# Altium schematic sheet ATU_RF.SchDoc: Приемопередатчик  SDR200
size 420 x 297 mm; Author: В.Титов; DrawnBy: В.Титов; DocumentNumber: ХХХХ.468179.001 Э3; SheetNumber: 2; SheetTotal: 3; DocumentType: Схема электрическая принципиальная; Title2: Согласующее устройство; Scale: 1:1
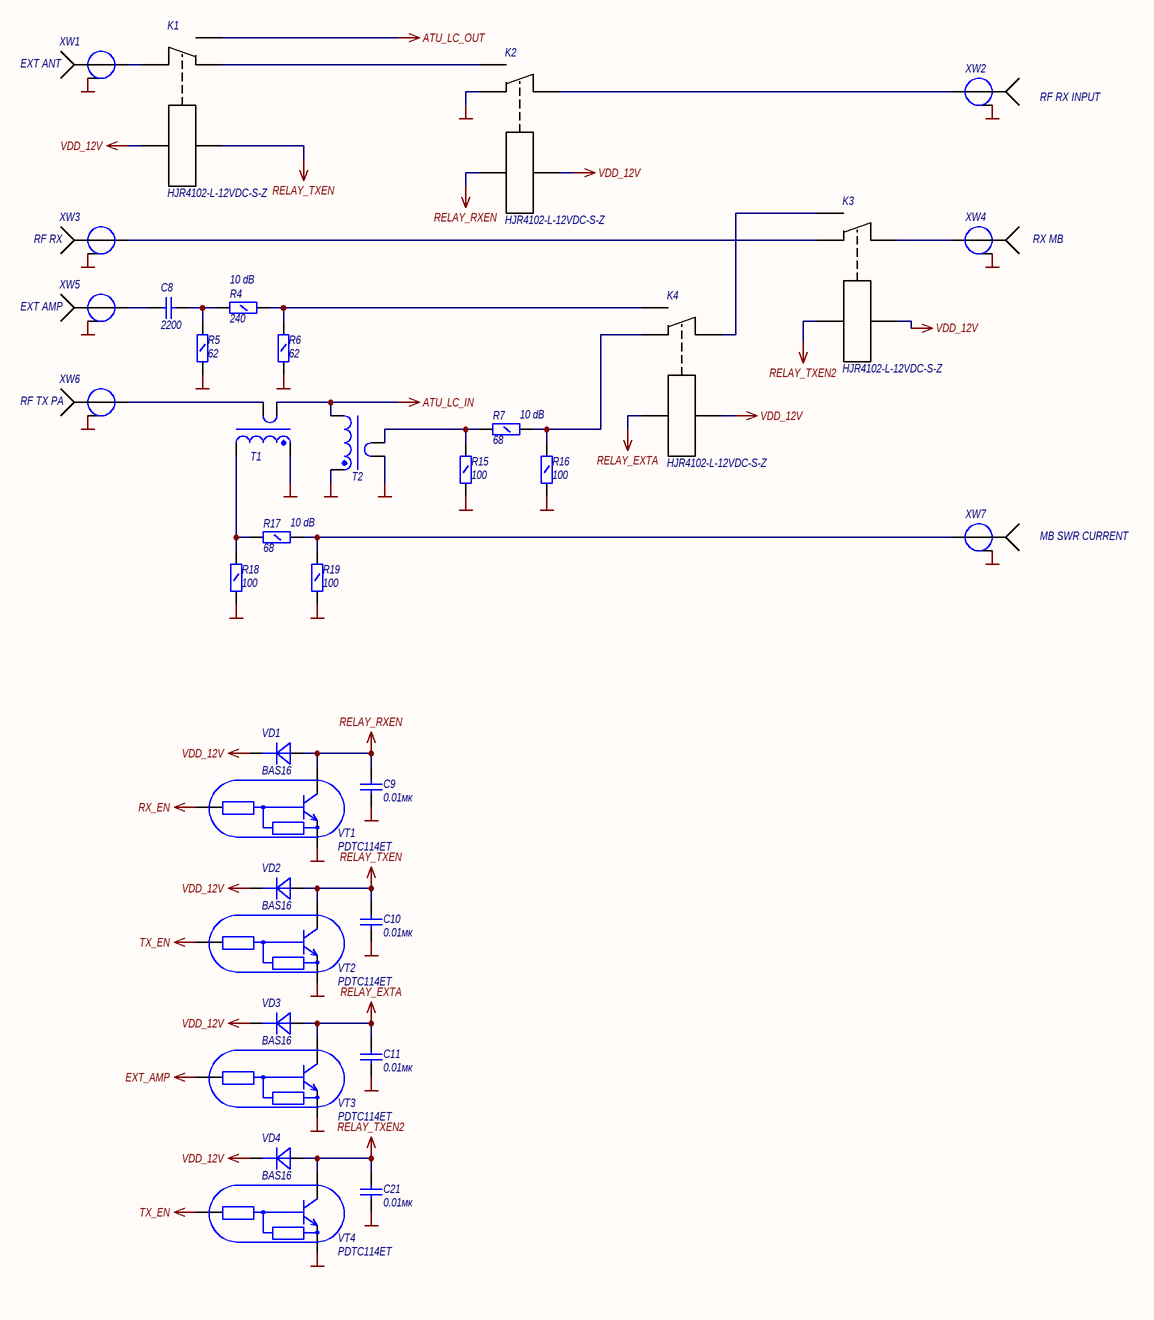
[diagram p0: ATU_RF.SchDoc]

## Parts
C8  2200  [CAPC3216X19L]
C9  0.01мк  [CAPC1005X06N]
C10  0.01мк  [CAPC1005X06N]
C11  0.01мк  [CAPC1005X06N]
C21  0.01мк  [CAPC1005X06N]
K1  HJR4102-L-12VDC-S-Z  [HJR4102]
K2  HJR4102-L-12VDC-S-Z  [HJR4102]
K3  HJR4102-L-12VDC-S-Z  [HJR4102]
K4  HJR4102-L-12VDC-S-Z  [HJR4102]
R4  240  [RESC3216X04L]
R5  62  [RESC3216X04L]
R6  62  [RESC3216X04L]
R7  68  [RESC3216X04L]
R15  100  [RESC3216X04L]
R16  100  [RESC3216X04L]
R17  68  [RESC3216X04L]
R18  100  [RESC3216X04L]
R19  100  [RESC3216X04L]
T1  Трансформатор SWR_CURRENT  [TRSF PA CURRENT]  (value not drawn)
T2  Трансформатор SWR_VOLTAGE  [TRSF PA VOLTAGE]  (value not drawn)
VD1  BAS16  [SOT23_N]
VD2  BAS16  [SOT23_N]
VD3  BAS16  [SOT23_N]
VD4  BAS16  [SOT23_N]
VT1  PDTC114ET  [SOT23_N]
VT2  PDTC114ET  [SOT23_N]
VT3  PDTC114ET  [SOT23_N]
VT4  PDTC114ET  [SOT23_N]
XW1  SMA-JR  [SMA-JR]  (value not drawn)
XW2  SMA-JR  [SMA-JR]  (value not drawn)
XW3  SMA-JR  [SMA-JR]  (value not drawn)
XW4  SMA-JR  [SMA-JR]  (value not drawn)
XW5  SMA-JR  [SMA-JR]  (value not drawn)
XW6  SMA-JR  [SMA-JR]  (value not drawn)
XW7  SMA-JR  [SMA-JR]  (value not drawn)

## Nets
ATU_LC_IN: T1.1 T2.4
ATU_LC_OUT: K1.6
EXT_AMP: VT3.1(B)
GND: C9.1 C10.1 C11.1 C21.1 K2.7 R5.1 R6.1 R15.1 R16.1 R18.1 R19.1 T1.3 T2.1 T2.3 VT1.2(E) VT2.2(E) VT3.2(E) VT4.2(E) XW1.2 XW2.2 XW3.2 XW4.2 XW5.2 XW6.2 XW7.2
RELAY_EXTA: C11.2 K4.5 VD3.1(A) VT3.3(C)
RELAY_RXEN: C9.2 K2.5 VD1.1(A) VT1.3(C)
RELAY_TXEN: C10.2 K1.5 VD2.1(A) VT2.3(C)
RELAY_TXEN2: C21.2 K3.5 VD4.1(A) VT4.3(C)
RX_EN: VT1.1(B)
TX_EN: VT2.1(B) VT4.1(B)
VDD_12V: K1.8 K2.8 K3.8 K4.8 VD1.3(K) VD2.3(K) VD3.3(K) VD4.3(K)
NetC8_1: C8.1 R4.1 R5.2
NetC8_2: C8.2 XW5.1
NetK1_1: K1.1 XW1.1
NetK1_7: K1.7 K2.6
NetK2_1: K2.1 XW2.1
NetK3_1: K3.1 XW4.1
NetK3_6: K3.6 K4.1
NetK3_7: K3.7 XW3.1
NetK4_6: K4.6 R4.2 R6.2
NetK4_7: K4.7 R7.2 R16.2
NetR7_1: R7.1 R15.2 T2.2
NetR17_1: R17.1 R18.2 T1.4
NetR17_2: R17.2 R19.2 XW7.1
NetT1_2: T1.2 XW6.1

## Notes on the sheet
- (near XW1) EXT ANT
- RF RX INPUT
- (near XW3) RF RX
- (near R4) 10 dB
- RX MB
- EXT AMP
- (near XW6) RF TX PA
- (near R7) 10 dB
- (near R17) 10 dB
- MB SWR CURRENT
- Перв. примен.
- Справ. №
- Подп. и дата
- Инв. № дубл.
- Взам. инв. №
- Изм
- Лист
- № докум
- Подп.
- Дата
- Лит.
- Масса
- Масштаб
- Т. контр.
- Разраб.
- Пров.
- Листов
- Н. контр.
- Инв. № подп.
- Утв.
- Копировал
- Формат А3

## Library data of the parts
C8 = Кер.ЧИП конд. 1206 2200пФ X7К 10% 1000В: Кер. ЧИП-конденсатор; Manufacturer: WALSIN; ManufacturerPartNumber: 1206B222K102; Power/Voltage: 1000В; TKE: X7R; Tolerance: ±10%; Value: 2200
C9-C11 C21 = Кер.ЧИП конд. 0402 0.01мкФ X7R 10%, 50В: Кер. ЧИП-конденсатор; Power/Voltage: 50В; TKE: X7R; Tolerance: ±20%; Value: 0.01мк
K1-K4 = Реле HJR4102-L-12VDC-S-Z: Реле 1пер. 12VDC, 1A/240VAC; Value: HJR4102-L-12VDC-S-Z; ComponentLink1Description: datasheet; ComponentLink1URL: https://www.ti.com/lit/ds/symlink/tlvh431a.pdf?ts=1606914625003&ref_url=https%253A%252F%252Fwww.google.com%252F
R4 = Чип резистор 1206 240 Ом, 5%: ЧИП-резистор; Manufacturer: ROHM; Tolerance: ±5%; TKE: 300 ppm/°С; PackageReference: 1206; Value: 240
R5 R6 = Чип резистор 1206 62 Ом, 5%: ЧИП-резистор; Manufacturer: ROHM; Tolerance: ±5%; TKE: 300 ppm/°С; PackageReference: 1206; Value: 62
R7 R17 = Чип резистор 1206 68 Ом, 5%: ЧИП-резистор; Manufacturer: ROHM; Tolerance: ±5%; TKE: 300 ppm/°С; PackageReference: 1206; Value: 68
R15 R16 R18 R19 = Чип резистор 1206 100 Ом, 5%: ЧИП-резистор; Manufacturer: ROHM; Tolerance: ±5%; TKE: 300 ppm/°С; PackageReference: 1206; Value: 100
VD1-VD4 = ЧИП диод BAS16: High-speed switching diodes; Manufacturer: Nexperia; Power/Voltage: 100В; ManufacturerPartNumber: BAS16; Value: BAS16; ComponentLink1Description: datasheet; ComponentLink1URL: https://assets.nexperia.com/documents/data-sheet/BAS16_SER.pdf
VT1-VT4 = ЧИП транзистор PDTC114ET: NPN resistor-equipped transistors;  R1 = 10 k, R2 = 10; ComponentLink1Description: datasheet; ComponentLink1URL: https://assets.nexperia.com/documents/data-sheet/PDTC114E_SER.pdf; Value: PDTC114ET
XW1-XW7 = Соединитель коаксиальный SMA-JR: SMA-JR Разъем SMA гнездо на плату, прямой угол; Value: SMA-JR; ComponentLink1Description: datasheet; ComponentLink1URL: http://www.brownbear.ru/goods/2243.html